# Altium schematic sheet [1]_Power.SchDoc
size B
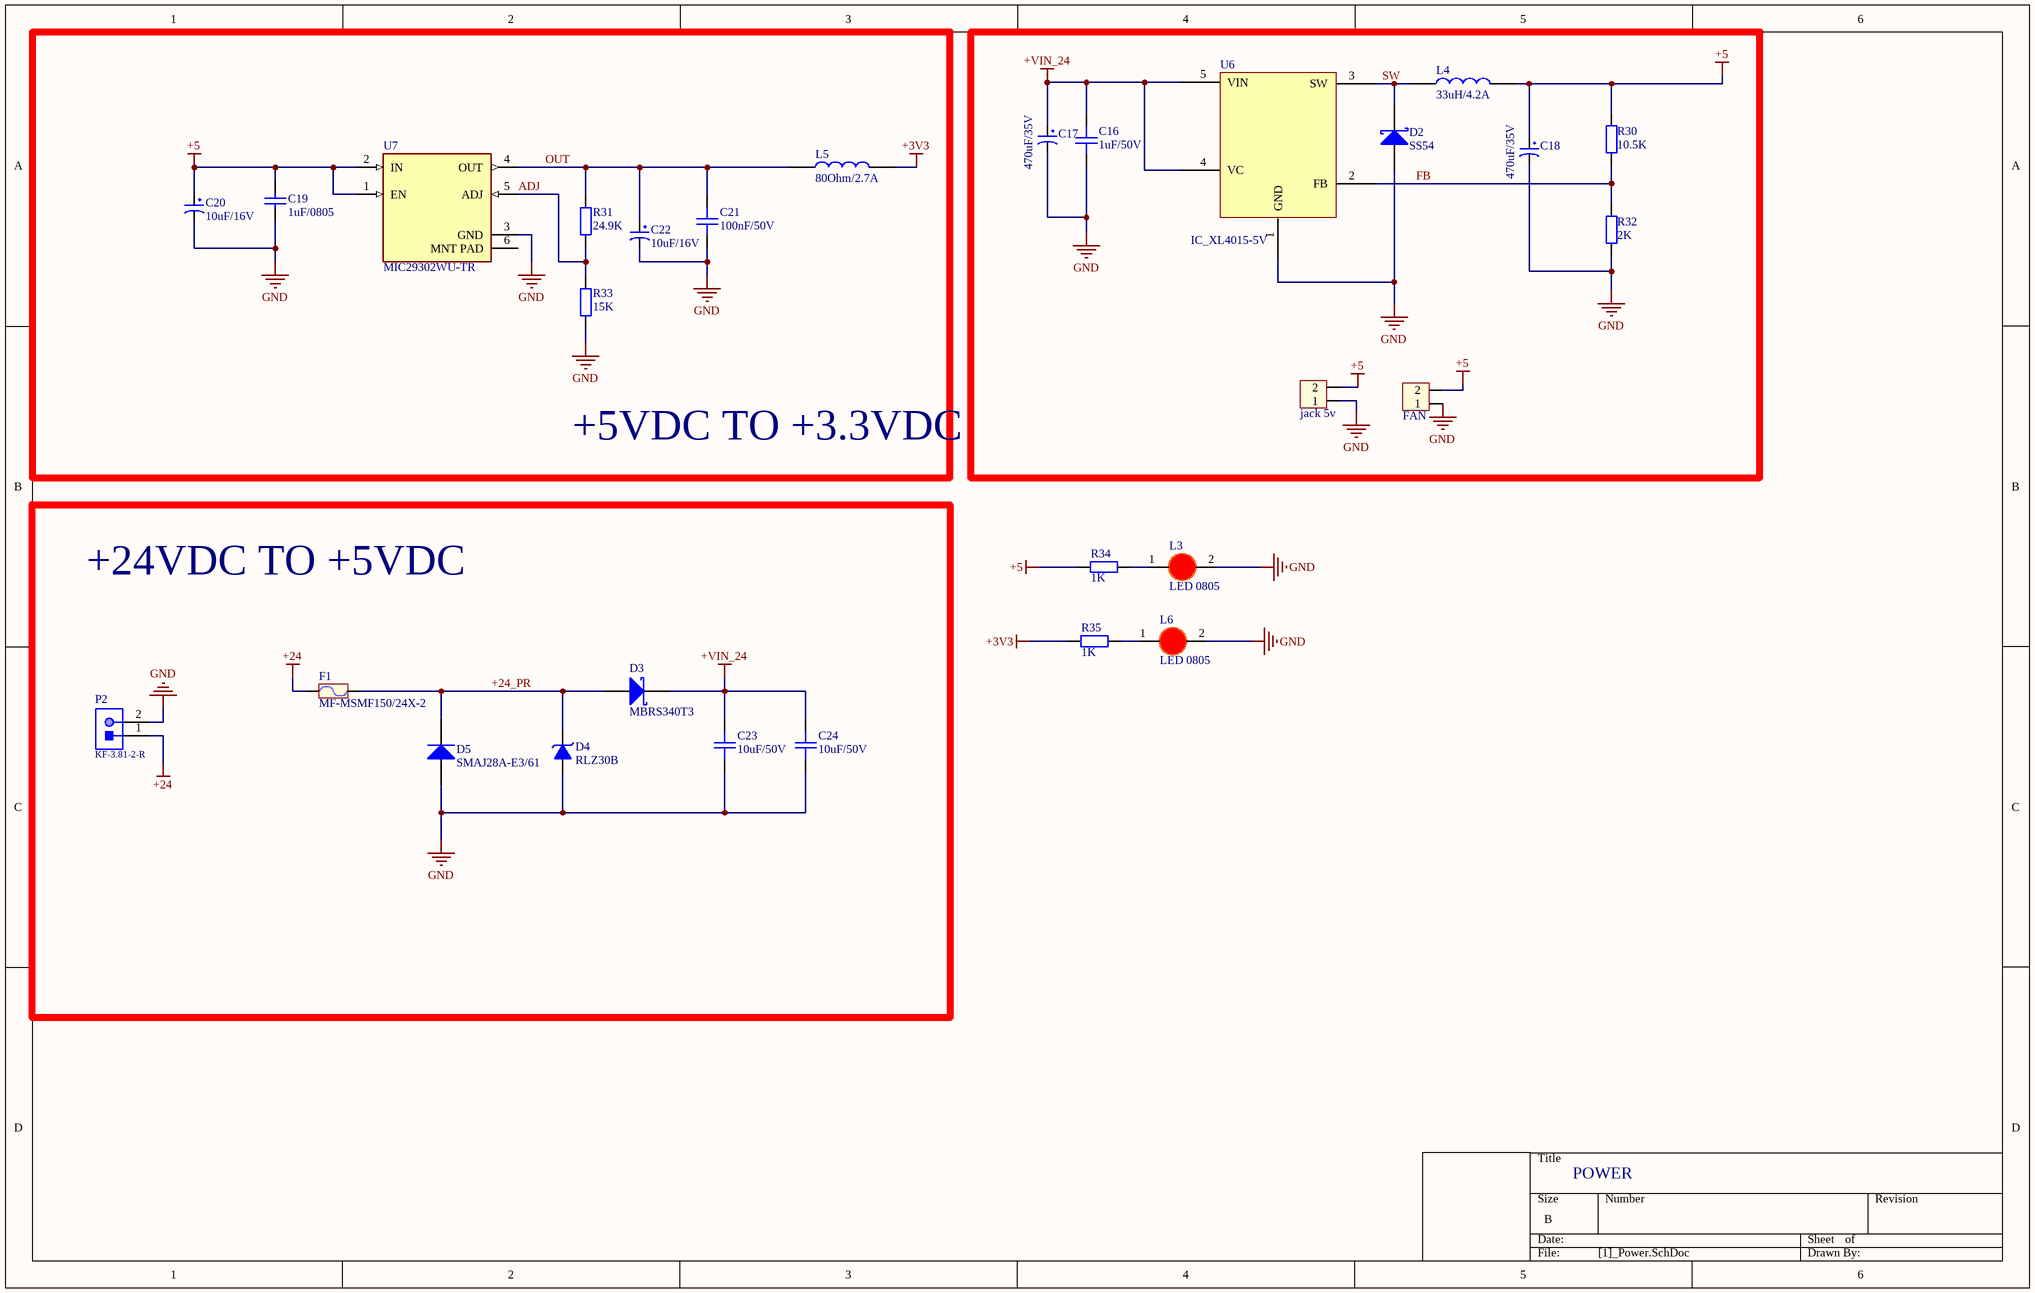
[diagram p0: [1]_Power.SchDoc]

## Parts
C16  1uF/50V  [1206]
C17  470uF/35V  [CAP_10_10]
C18  470uF/35V  [CAP_10_10]
C19  1uF/0805  [tu 0805]
C20  10uF/16V  [2312]
C21  100nF/50V  [C0805]
C22  10uF/16V  [2312]
C23  10uF/50V  [1210]
C24  10uF/50V  [1210]
D2  SS54  [DO-SMB-2]
D3  MBRS340T3  [DO214AB_SMC]
D4  RLZ30B  [SOD_80]
D5  SMAJ28A-E3/61  [VISH-DO-214AC-2_L]
F1  MF-MSMF150/24X-2  [1812]
H1  jack 5v  [VH3.96M-2]
H2  FAN  [XH2.54M-2]
L3  LED 0805  [LED-0805-Red]
L4  33uH/4.2A  [IND-12_12_8]
L5  80Ohm/2.7A  [FER-0805 (2012)]
L6  LED 0805  [LED-0805-Red]
P2  KF-3.81-2-R  [691322310002]
R30  10.5K  [R1206]
R31  24.9K  [tro smd 0805]
R32  2K  [R0805]
R33  15K  [tro smd 0805]
R34  1K  [R0805]
R35  1K  [R0805]
U6  IC_XL4015-5V  [TO-263-5]
U7  MIC29302WU-TR  [FP-C04-012-MFG]

## Blocks framed on the sheet
+5VDC TO +3.3VDC: C19-C22 L5 R31 R33 U7
+24VDC TO +5VDC: C23 C24 D3-D5 F1 P2

## Nets
+3V3: L5.2 R35.2
+5: C18.1 C19.1 C20.1 H1.2 H2.2 L4.2 R30.1 R34.2 U7.1(EN) U7.2(IN)
+24: F1.1 P2.1
+VIN_24: C16.2 C17.1 C23.2 C24.2 D3.2(K) U6.4(VC) U6.5(VIN)
GND: C16.1 C17.2 C18.2 C19.2 C20.2 C21.1 C22.2 C23.1 C24.1 D2.1(A) D4.1(A) D5.2(A) H1.1 H2.1 L3.2(K) L6.2(K) P2.2 R32.1 R33.1 U6.1(GND) U7.3(GND)
+24_PR: D3.1(A) D4.2(K) D5.1(K) F1.2
ADJ: R31.1 R33.2 U7.5(ADJ)
FB: R30.2 R32.2 U6.2(FB)
OUT: C21.2 C22.1 L5.1 R31.2 U7.4(OUT)
SW: D2.2(K) L4.1 U6.3(SW)
NetL3_1: L3.1(A) R34.1
NetL6_1: L6.1(A) R35.1

Not connected (* = marked no-connect by the designer): U7 6(MNT_PAD)

## Notes on the sheet
- POWER

## Library data of the parts
C16 = CAP_CER_1206_1uF: CAP CER 10uF/50V 1206; Manufacturer: Samsung; Part number: C1206; Cost: 500; ComponentLink1Description: Link product; ComponentLink1URL: https://www.thegioiic.com/tu-gom-1206-1uf-50v; Package: 1206
C17 C18 = CAP_ALUM_10_10_33uF/100V: CAP ALUM 33uF/100V 10x10.5; Manufacturer: OEM; Part number: ALUM_33uF; Cost: 2900; ComponentLink1Description: Link product; ComponentLink1URL: https://www.thegioiic.com/tu-nhom-smd-33uf-100v-10x10-5mm; Package: 10x10.5
C19 = Tu 0805 104 50V 10%: Dán; Don_Vi: Con; So_Chan: 2; Ten_Linh_Kien: Tụ 0805 104-100nF 10% 50V; Ma_Hang: MH004551; Chung_Loai: Dán; Kieu_Chan: *; ComponentLink1Description: New link; ComponentLink1URL: https://www.thegioiic.com/tu-gom-0805-1uf-25v
C20 C22 = CAP_TANT_2312_100uF: CAP TANT 100uF/10V 2312; Manufacturer: AVX; Part number: TAJC107K010RNJ; Cost: 5000; ComponentLink1Description: Link product; ComponentLink1URL: https://www.thegioiic.com/tu-tantalum-100uf-10v-2312-tajc107k010rnj; Package: 2312
C21 = CAP_CER_0805_100nF: CAP CER 100nF/50V 0805; Manufacturer: Samsung; Cost: 190; Part number: C0805; ComponentLink1Description: Link product; ComponentLink1URL: https://www.thegioiic.com/tu-gom-0805-100nf-0-1uf-50v; Package: 0805
C23 C24 = CAP_CER_1210_10uF: CAP CER 10uF/50V 1210; Manufacturer: Yageo; Part number: C1210; Cost: 3400; ComponentLink1Description: Link product; ComponentLink1URL: https://www.thegioiic.com/tu-gom-1210-10uf-50v; Package: 1210
D2 = DIO_SS54: DIODE SCHOTTKY 5A 40V SMB; Manufacturer: Vishay; Cost: 1800; Part number: SS54; Package: SMB; ComponentLink1Description: Link product; ComponentLink1URL: https://www.thegioiic.com/ss54-smb
D3 = DIO_MBRS340T3: DIODE SCHOTTKY 4A 40V SMC DO-214AB; Manufacturer: Fairchild; Part number: SS14; Cost: 2000; Package: DO-214AB; ComponentLink1Description: Link product; ComponentLink1URL: https://www.thegioiic.com/mbrs340t3-diode-schottky-4a
D4 = DIO_ZMM15: ZMM15 15V 500mW SMD SOD-80; Manufacturer: On Semiconductor; Cost: 250; Part number: ZMM15; Package: SOD-80 2L; ComponentLink1Description: Link product; ComponentLink1URL: https://www.thegioiic.com/rlz30b-diode-zener-27-70-29-13v-500mw-smd
D5 = CMP-0548-00227-2: Transient Voltage Suppressor, 6.40 to 231 V, 28 V Stand-off Voltage, Uni-Directional, -55 to 155 degC, 2-pin DO-214AC, Pb-Free, Tape and Reel; Manufacturer: Vishay Semiconductor; IFSM: 40 A; VBR Uni-Directional (V): 6.4 to 231; ID (uA): 1; VWM (V): 28; PPPM (W): 400, 300; PackageReference: DO-214AC-2; Packing: Tape and Reel; RoHS: TRUE; PartNumber: SMAJ28A-E3/61; PackageDescription: 2-Pin DO-214AC (SMA), Body 4.245 x 2.665 mm; Mounting Technology: Surface Mount; DatasheetVersion: 12/8/2013; Operating Junction and Storage Temperature Range: -55 to 150 degC; ComponentLink4Description: New link; ComponentLink4URL: https://www.thegioiic.com/smaj28a-e3-61-tvs-diode-28v-45-4v-do214ac
F1 = FUSE_16V_2.5A: MF-MSMF250/16 16V 2.5A1812; Manufacturer: Bourns; Cost: 3000; Part number: 1812; ComponentLink1Description: Link product; ComponentLink1URL: https://www.thegioiic.com/mf-msmf150-24x-2-cau-chi-tu-phuc-hoi-1812-24v-1-5a; Package: 1812
H1 = Header 2P VH3.96 Duc Thang: Cắm; Ten_Linh_Kien: Header 2P XH2.54-2P Đực Thẳng; Don_Vi: Con; Ma_Hang: MH001283; Chung_Loai: Cắm
H2 = Header 2P 2.54 Duc Thang: Cắm; Ten_Linh_Kien: Header 2P XH2.54-2P Đực Thẳng; Don_Vi: Con; Ma_Hang: MH001283; Chung_Loai: Cắm
L3 L6 = LED 0805 Do: Dán; Don_Vi: Con; Ma_Hang: MH000897; Ten_Linh_Kien: LED 0805 Màu Đỏ (Red); Ghi_Chu: *; Kieu_Chan: *; Chung_Loai: Dán
L4 = IND_33uH_4.2A_1280: CDRH127 IND 33uH 4.2A 12x12x8; Manufacturer: OEM; Cost: 3200; Part number: CDRH127; Package: 1280; ComponentLink1Description: Link product; ComponentLink1URL: https://www.thegioiic.com/cdrh127-cuon-cam-dan-smd-1280-330-33uh-4-2a
L5 = FERRITE_BEAD_2.7A_80: FERRITE BEAD 2.7A 80 OHM 0805; Manufacturer: Taiyo Yuden; Part number: FBMH2012HM800-T; Cost: 2000; Package: 0805; ComponentLink1Description: Link product; ComponentLink1URL: https://www.thegioiic.com/fbmh2012hm800-t-ferrite-bead-80-ohm-0805
P2 = CMP-1502-01886-1: Serie 322 - 3.81mm Horizontal PCB Header WR-TBL, 2 pin; Manufacturer: Wurth Elektronik; Gender: Male; Pin Number: 2; Publisher: WurthElektronik; Pitch: 3.81mm; Packaging: Box; Part Number: 691322310002; Manufacturer URL: http://www.we-online.de; Operating Temperature: -40to105degC; Mounting Technology: THT; Datasheet URL: http://katalog.we-online.de/em/datasheet/6913223100xx.pdf; Package Reference: 691322310002
R30 = RES_1206_3.3K: RES 1206 3.3K; Manufacturer: OEM; Cost: 116; Part number: R1206; ComponentLink1Description: Link product; ComponentLink1URL: https://www.thegioiic.com/dien-tro-3-3-kohm-1206-1-; Package: 1206
R31 = Tro 0805 5% 20k: Dán; Don_Vi: Con; So_Chan: 2; Ten_Linh_Kien: Trở 0805 5% 20k; Ma_Hang: MH005247; Chung_Loai: Dán; Kieu_Chan: *; ComponentLink1Description: New link; ComponentLink1URL: https://www.thegioiic.com/dien-tro-100-kohm-0805-1
R32 R34 R35 = RES_0805_0K: RES 0805 0K; Manufacturer: OEM; Cost: 48; Part number: R0805; ComponentLink1Description: Link product; ComponentLink1URL: https://www.thegioiic.com/dien-tro-2-kohm-0805-1; Package: 0805
R33 = Tro 0805 5% 47k: Dán; Don_Vi: Con; So_Chan: 2; Ten_Linh_Kien: Trở 0805 5% 47k; Ma_Hang: MH005320; Chung_Loai: Dán; Kieu_Chan: *; ComponentLink1Description: New link; ComponentLink1URL: https://www.thegioiic.com/dien-tro-43-kohm-0805-5
U6 = IC_XL4015-5V: XL4015E1 Buck converter 5A TO 263; Manufacturer: XLSEMI; Cost: 16000; Part number: XL4015E1; ComponentLink1Description: Link product; ComponentLink1URL: https://www.thegioiic.com/xl4015e1-ic-dieu-chinh-giam-ap-5a-to-263-5; Package: TO-263-5
U7 = CMP-06324-000007-1: IC REG LINEAR POS ADJ 3A TO263-5; Manufacturer: Microchip; Output Voltage: 3.3-12V; Output Type: AdjustableProgrammable; Max Junction Temp: +125°C; Standoff Height: 0mm; Accuracy Percentage: 1%; Max Supply Voltage: 26V; Nominal Supply Current: 10-37mA; Number Of Outputs: 1; Dropout Voltage: 370mV; Min Supply Voltage: 2.25V; Device Class L1: Integrated Circuits (ICs); Digikey Description: IC REG LINEAR POS ADJ 3A TO263-5; Device Class L2: Power Management ICs; Lead Free: Yes; Mouser Description: LDO Voltage Regulators; Package: C04-012; Temperature: -40°C to +125°C; Temperature Range High: +125°C; Automotive: No; Device Class L3: Voltage Regulators - Linear; Category: IC; Temperature Range Low: -40°C; RoHS: TRUE; Output Current: 3A; Octopart: https://octopart.com/mic29302wu-tr-microchip-66801318; Manufacturer Part Number: MIC29302WU-TR; Height: 0.2inch; ComponentLink3Description: New link; ComponentLink3URL: https://www.thegioiic.com/mic29302-ic-dieu-chinh-dien-ap-3a